# EAGLE design RefOsc10MHz_2V1 (EAGLE 7.2.0)
DF4IAH - 10 MHz Reference Oscillator

## Sheet 1 of 2: Main
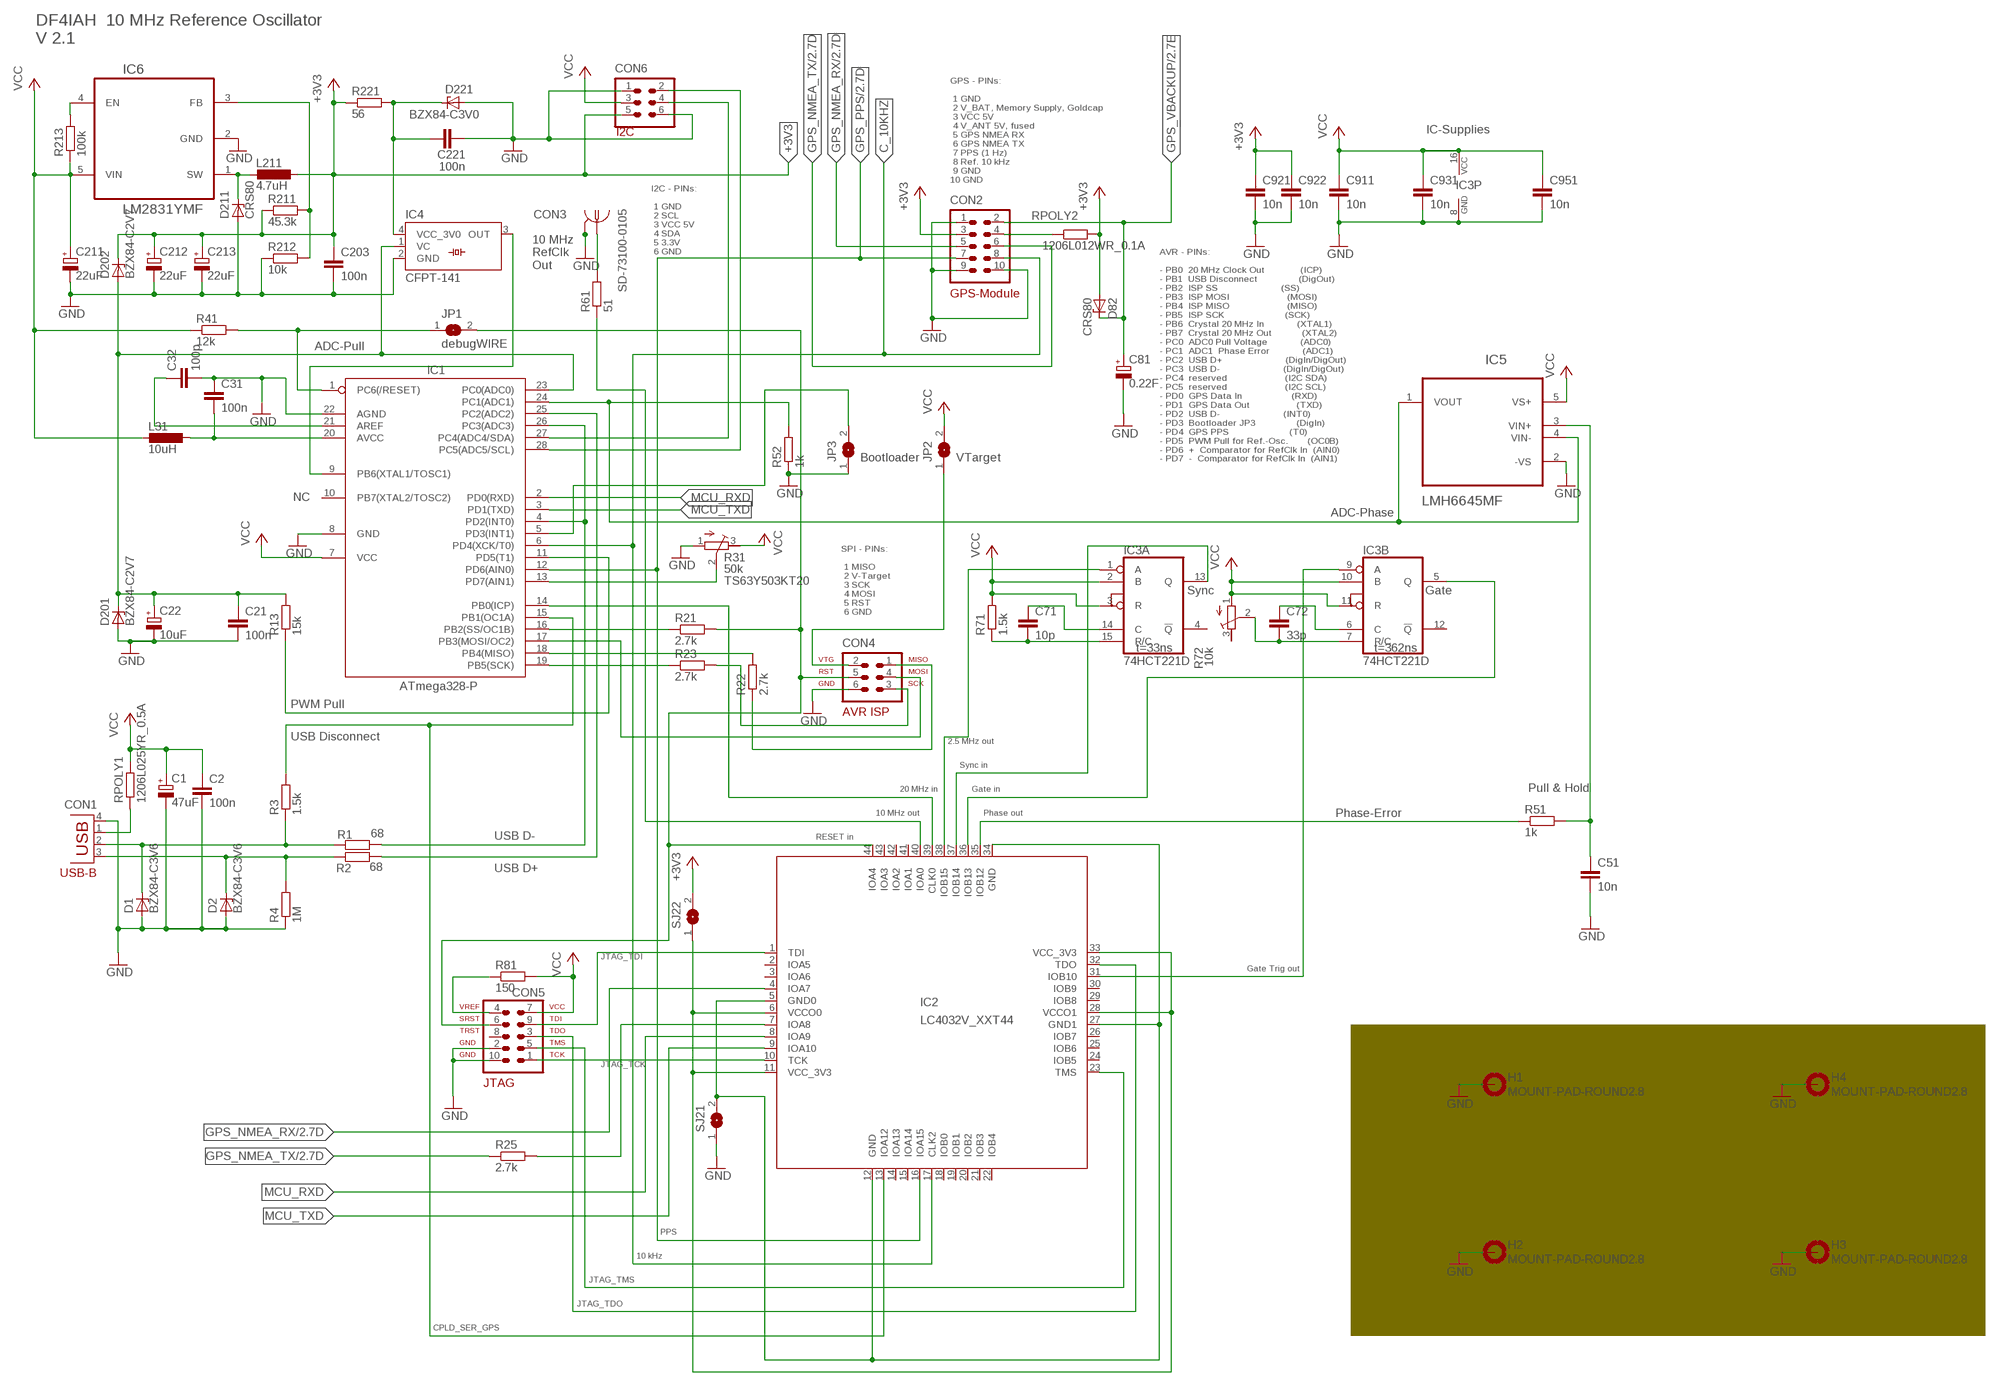
[diagram p0: schematic, sheet 1]

### Parts
C1  47uF  CPOL-EUC  [PANASONIC_C]
C2  100n  C-EUC0805  [C0805]
C21  100n  C-EUC0805  [C0805]
C22  10uF  CPOL-EUB  [PANASONIC_B]
C31  100n  C-EUC0805  [C0805]
C32  100p  C-EUC0805  [C0805]
C51  10n  C-EUC0805  [C0805]
C71  10p  C-EUC0805  [C0805]
C72  33p  C-EUC0805  [C0805]
C81  0.22F  CPOL-EU140CLH-1010  [140CLH-1010]
C203  100n  C-EUC0805  [C0805]
C211  22uF  CPOL-EUA/3216-18W  [A/3216-18W]
C212  22uF  CPOL-EUA/3216-18W  [A/3216-18W]
C213  22uF  CPOL-EUA/3216-18W  [A/3216-18W]
C221  100n  C-EUC0805  [C0805]
C911  10n  C-EUC0805  [C0805]
C921  10n  C-EUC0805  [C0805]
C922  10n  C-EUC0805  [C0805]
C931  10n  C-EUC0805  [C0805]
C951  10n  C-EUC0805  [C0805]
CON1  TYCO-AMP_USBUSB-B_SMT  [TYCO-AMP_USB-B_SMT]
CON2  HEADER-2X5SMD  [2X5SMD]
CON3  SD-73100-0105  MOLEX_BNC-JACK-50R_SD-73100-0105  [MOLEX_BNC-JACK-50R_SD-73100-0105]
CON4  AVR-ISP-6SMD  [2X3SMD]
CON5  AVR-JTAG-10SMD  [2X5SMD]
CON6  HEADER-2X3SMD  [2X03SMD]
D1  BZX84-C3V6  BZX84CSMD  [TO236]
D2  BZX84-C3V6  BZX84CSMD  [TO236]
D82  CRS80  ZENER-DIODESOD80C  [SOD80C]
D201  BZX84-C2V7  BZX84CSMD  [TO236]
D202  BZX84-C2V7  BZX84CSMD  [TO236]
D211  CRS80  ZENER-DIODESOD80C  [SOD80C]
D221  BZX84-C3V0  BZX84CSMD  [TO236]
H1  MOUNT-PAD-ROUND2.8  [2,8-PAD]
H2  MOUNT-PAD-ROUND2.8  [2,8-PAD]
H3  MOUNT-PAD-ROUND2.8  [2,8-PAD]
H4  MOUNT-PAD-ROUND2.8  [2,8-PAD]
IC1  ATmega328-P  MEGA8-P  [DIL28-3]
IC2  LC4032V_XXT44  [TQFP44]
IC3  74HCT221D  [SO16]
IC4  CFPT-141  [CFPT-141]
IC5  LMH6645MF  [SOT95P280X145-5N]
IC6  LM2831YMF  [SOT95P280X145-5N]
JP1  SJW  [SJW]
JP2  SJW  [SJW]
JP3  SJW  [SJW]
L31  10uH  L-EUL1812  [L1812]
L211  4.7uH  L-EUL5650M  [L5650M]
R1  68  R-EU_R0805  [R0805]
R2  68  R-EU_R0805  [R0805]
R3  1.5k  R-EU_R0805  [R0805]
R4  1M  R-EU_R0805  [R0805]
R13  15k  R-EU_R0805  [R0805]
R21  2.7k  R-EU_R0805  [R0805]
R22  2.7k  R-EU_R0805  [R0805]
R23  2.7k  R-EU_R0805  [R0805]
R25  2.7k  R-EU_R0805  [R0805]
R31  50k  R-TRIMMTS63Y  [RTRIMTS63Y]
R41  12k  R-EU_R0805  [R0805]
R51  1k  R-EU_R0805  [R0805]
R52  1k  R-EU_R0805  [R0805]
R61  51  R-EU_R0805  [R0805]
R71  1.5k  R-EU_R0805  [R0805]
R72  10k  R-TRIMMTS63Y  [RTRIMTS63Y]
R81  150  R-EU_R0805  [R0805]
R211  45.3k  R-EU_R0805  [R0805]
R212  10k  R-EU_R0805  [R0805]
R213  100k  R-EU_R0805  [R0805]
R221  56  R-EU_R0805  [R0805]
RPOLY1  1206L025YR_0.5A  R-EU_M1206  [M1206]
RPOLY2  1206L012WR_0.1A  R-EU_M1206  [M1206]
SJ21  SJ  [SJ]
SJ22  SJ  [SJ]

### Nets
+3V0 [N3V3]: C221.1 D221.C IC4.4(VCC_3V0) R221.2
+3V3 [N3V3]: C203.1 C212.+ C213.+ C921.1 C922.1 CON2.3 CON6.5 D82.A D202.C L211.1 R211.1 R221.1 RPOLY2.2 SJ22.2 ; also sheet 2
ADC_PHASE: IC1.24(PC1(ADC1)) IC5.1(VOUT) IC5.4(VIN-) R52.2
ADC_PHASE_PULLHOLD: C51.1 IC5.3(VIN+) R51.2
AIN1: IC1.13(PD7(AIN1)) R31.2(S)
AREF: C32.1 IC1.21(AREF)
AVCC: C31.2 IC1.20(AVCC) L31.1
C_2MHZ5: IC2.38(IOB15) IC3.1(A:A)
C_10KHZ: CON2.8 IC1.6(PD4(XCK/T0)) IC2.17(CLK2)
C_10MHZ: IC2.40(IOA0) R61.1
C_20MHZ: IC1.14(PB0(ICP)) IC2.39(CLK0)
CPLD_GPS_NMEA_TX: IC2.7(IOA8) R25.2
EN: IC6.4(EN) R213.2
FB: IC6.3(FB) R211.2 R212.2
GATE: IC2.36(IOB13) IC3.5(B:Q)
GATE_TRIG: IC2.31(IOB10) IC3.9(B:A)
GND [N0V]: C1.- C2.2 C21.2 C22.- C31.1 C32.2 C51.2 C81.- C203.2 C211.- C212.- C213.- C221.2 C911.2 C921.2 C922.2 C931.2 C951.2 CON1.4(GND) CON2.1 CON2.9 CON2.10 CON3.2 CON3.3 CON4.6 CON5.2 CON5.10 CON6.1 CON6.6 D1.A D2.A D201.A D211.A D221.A H1.B2,8(MOUNT) H2.B2,8(MOUNT) H3.B2,8(MOUNT) H4.B2,8(MOUNT) IC1.8(GND) IC1.22(AGND) IC3.8(P:GND) IC4.2(GND) IC5.2(-VS) IC6.2(GND) JP3.1 R4.1 R31.1(A) R52.1 R212.1 SJ21.1 ; also sheet 2
GND_SJ1: IC2.5(GND0) IC2.12(GND) IC2.27(GND1) IC2.34(GND) SJ21.2
GPS_ANT_PWR [N5V]: CON2.4 RPOLY2.1
GPS_NMEA_RX: CON2.5 IC2.4(IOA7) ; also sheet 2
GPS_NMEA_TX: CON2.6 R25.1 ; also sheet 2
GPS_PPS: CON2.7 IC1.12(PD6(AIN0)) IC2.16(IOA15) ; also sheet 2
GPS_VBACKUP: C81.+ CON2.2 D82.C ; also sheet 2
INT1: IC1.5(PD3(INT1)) JP3.2
ISP_MISO: CON4.1 R22.1
ISP_MOSI: CON4.4 IC1.17(PB3(MOSI/OC2))
ISP_SCK: CON4.3 R23.2
ISP_VTARGET: CON4.2 JP2.1
JTAG_SRST: CON4.5 CON5.6 IC2.44(IOA4) JP1.2 R21.2
JTAG_TCK: CON5.1 IC2.10(TCK)
JTAG_TDI: CON5.9 IC2.1(TDI)
JTAG_TDO: CON5.3 IC2.32(TDO)
JTAG_TMS: CON5.5 IC2.23(TMS)
JTAG_VREF: CON5.4 R81.1
MCU_RXD: IC1.2(PD0(RXD)) IC2.8(IOA9)
MCU_TXD: IC1.3(PD1(TXD)) IC2.9(IOA10)
MISO: IC1.18(PB4(MISO)) R22.2
N$1: CON6.2 IC1.28(PC5(ADC5/SCL))
N$3: CON6.4 IC1.27(PC4(ADC4/SDA))
N$42: CON3.1 R61.2
N$44: C72.2 IC3.7(B:R/C) R72.2(S)
N$45: C72.1 IC3.6(B:C)
N$47: C71.2 IC3.15(A:R/C) R71.1
N$48: C71.1 IC3.14(A:C)
N_ADC_PULL: C21.1 C22.+ D201.C D202.A IC1.23(PC0(ADC0)) IC4.1(VC) R13.2
N_PWM_PULL: IC1.11(PD5(T1)) R13.1
N_USB_DISC: IC1.15(PB1(OC1A)) IC2.13(IOA12) R3.2
N_USB_DMNS: IC1.4(PD2(INT0)) IC1.26(PC3(ADC3)) R1.2
N_USB_DPLS: IC1.25(PC2(ADC2)) R2.2
PHASE_ERROR: IC2.35(IOB12) R51.1
RESET: IC1.1(PC6(/RESET)) JP1.1 R41.2
SCK: IC1.19(PB5(SCK)) R23.1
SS: IC1.16(PB2(SS/OC1B)) R21.1
SW [N3V3]: D211.C IC6.1(SW) L211.2
SYNC: IC2.37(IOB14) IC3.13(A:Q)
TOSC1: IC1.9(PB6(XTAL1/TOSC1)) IC4.3(OUT)
USB_D_MIN: CON1.2(D-) D1.C R1.1 R3.1
USB_D_PLS: CON1.3(D+) D2.C R2.1 R4.2
USB_PWR: CON1.1(VBUS) RPOLY1.1
VCC [N5V]: C1.+ C2.1 C211.+ C911.1 C931.1 C951.1 CON5.7 CON6.3 IC1.7(VCC) IC3.2(A:B) IC3.3(A:R) IC3.10(B:B) IC3.11(B:R) IC3.16(P:VCC) IC5.5(VS+) IC6.5(VIN) JP2.2 L31.2 R31.3(E) R41.1 R71.2 R72.1(A) R81.2 R213.1 RPOLY1.2
VCC_3V3_SJ2: IC2.6(VCCO0) IC2.11(VCC_3V3) IC2.28(VCCO1) IC2.33(VCC_3V3) SJ22.1
Unconnected: CON5.8 IC1.10(PB7(XTAL2/TOSC2)) IC2.2(IOA5) IC2.3(IOA6) IC2.14(IOA13) IC2.15(IOA14) IC2.18(IOB0) IC2.19(IOB1) IC2.20(IOB2) IC2.21(IOB3) IC2.22(IOB4) IC2.24(IOB5) IC2.25(IOB6) IC2.26(IOB7) IC2.29(IOB8) IC2.30(IOB9) IC2.41(IOA1) IC2.42(IOA2) IC2.43(IOA3) IC3.4(A:!Q) IC3.12(B:!Q) R72.3(E)

### Notes on the sheet
- DF4IAH  10 MHz Reference Oscillator
  V 2.1
- I2C | IC-Supplies
- GPS - PINs:
  
   1 GND
   2 V_BAT, Memory Supply, Goldcap
   3 VCC 5V
   4 V_ANT 5V, fused
   5 GPS NMEA RX
   6 GPS NMEA TX
   7 PPS (1 Hz)
   8 Ref. 10 kHz
   9 GND
  10 GND
- I2C - PINs:
  
   1 GND
   2 SCL
   3 VCC 5V
   4 SDA
   5 3.3V
   6 GND
- 10 MHz
  RefClk
  Out
- GPS-Module
- ADC-Pull | debugWIRE
- Bootloader | VTarget
- AVR - PINs:
  
  - PB0  20 MHz Clock Out             (ICP)
  - PB1  USB Disconnect               (DigOut)
  - PB2  ISP SS                       (SS)
  - PB3  ISP MOSI                     (MOSI)
  - PB4  ISP MISO                     (MISO)
  - PB5  ISP SCK                      (SCK)
  - PB6  Crystal 20 MHz In            (XTAL1)
  - PB7  Crystal 20 MHz Out           (XTAL2)
  - PC0  ADC0 Pull Voltage            (ADC0)
  - PC1  ADC1  Phase Error            (ADC1)
  - PC2  USB D+                       (DigIn/DigOut)
  - PC3  USB D-                       (DigIn/DigOut)
  - PC4  reserved                     (I2C SDA)
  - PC5  reserved                     (I2C SCL)
  - PD0  GPS Data In                  (RXD)
  - PD1  GPS Data Out                 (TXD)
  - PD2  USB D-                       (INT0)
  - PD3  Bootloader JP3               (DigIn)
  - PD4  GPS PPS                      (T0)
  - PD5  PWM Pull for Ref.-Osc.       (OC0B)
  - PD6  +  Comparator for RefClk In  (AIN0)
  - PD7  -  Comparator for RefClk In  (AIN1)
- NC
- ADC-Phase
- Sync | Gate
- SPI - PINs:
  
   1 MISO
   2 V-Target
   3 SCK
   4 MOSI
   5 RST
   6 GND
- t=33ns | t=362ns
- PWM Pull
- USB Disconnect
- 2.5 MHz out
- Sync in
- 20 MHz in | Gate in | Pull & Hold
- 10 MHz out | Phase out | Phase-Error
- USB D- | RESET in
- USB D+
- USB-B
- JTAG_TDI
- Gate Trig out
- JTAG_TCK
- PPS
- 10 kHz
- JTAG_TMS
- JTAG_TDO
- CPLD_SER_GPS

## Sheet 2 of 2: GPS-Unit
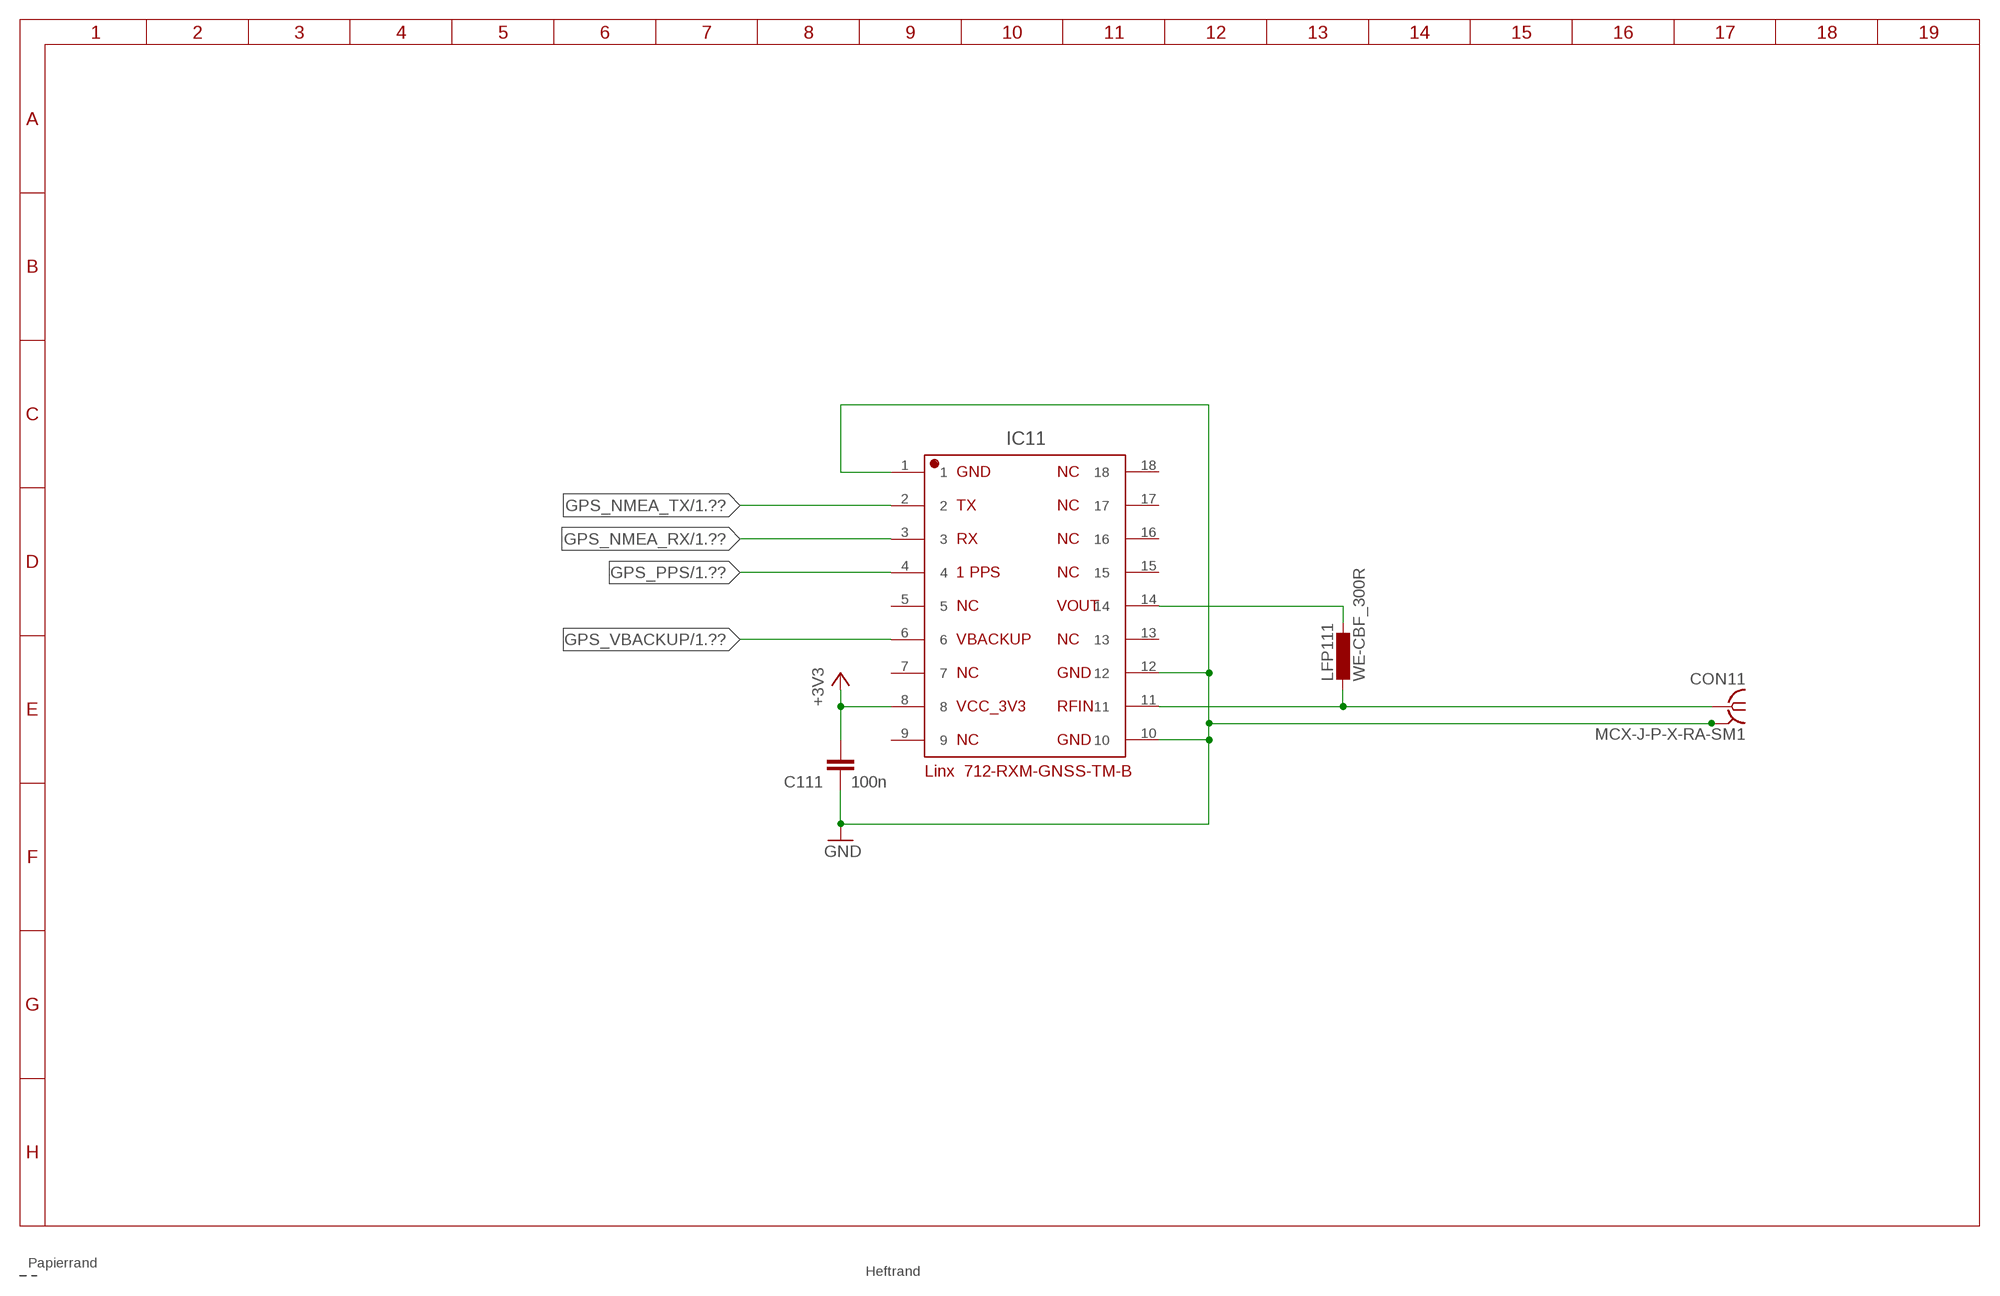
[diagram p1: schematic, sheet 2]

### Parts
C111  100n  C-EUC0805  [C0805]
CON11  MCX-J-P-X-RA-SM1  [MCX-J-P-X-RA-SM1]
IC11  712-RXM-GNSS-TM-B  [712-RXM-GNSS-TM-B]
LFP111  WE-CBF_300R  L-EUL3216C  [L3216C]

### Nets
14: IC11.14 LFP111.1
+3V3 [N3V3]: C111.1 IC11.8 ; also sheet 1
GND [N0V]: C111.2 CON11.2 CON11.3 CON11.4 CON11.5 IC11.1 IC11.10 IC11.12 ; also sheet 1
GPS_HF: CON11.1 IC11.11 LFP111.2
GPS_NMEA_RX: IC11.3 ; also sheet 1
GPS_NMEA_TX: IC11.2 ; also sheet 1
GPS_PPS: IC11.4 ; also sheet 1
GPS_VBACKUP: IC11.6 ; also sheet 1
Unconnected: IC11.5 IC11.7 IC11.9 IC11.13 IC11.15 IC11.16 IC11.17 IC11.18

## Library data of the parts
C1 C22 C81 C211-C213 = rcl:CPOL-EU: POLARIZED CAPACITOR, European symbol
C2 C21 C31 C32 C51 C71 C72 C203 C221 C911 C921 C922 C931 C951 = rcl:C-EU: CAPACITOR, European symbol
C111 = df4iah:C-EU: CAPACITOR, European symbol
CON1 = df4iah:TYCO-AMP_USB: TYCO-AMP USB-Connectors From Catalog 7-1773422-0 Issued 03-06; MF: TYCO-AMP; MPN: 1734346; OC_FARNELL: 1321918
CON2 = df4iah:HEADER-2X5: Header 2X5 2.54mm ISP, JTAG, ...
CON3 = df4iah:MOLEX_BNC-JACK-50R_SD-73100-0105: MOLEX BNC-Jack 50 Ohm SD-73100-0102; MF: MOLEX; MPN: SD-73100-0105; OC_FARNELL: 1909203; OC_NEWARK: -
CON4 = atmel-1:AVR-ISP-6: AVR ISP-6 Serial Programming Header
CON5 = df4iah:AVR-JTAG-10: AVR JTAG Debug/Programming Header
CON6 = df4iah:HEADER-2X3: Header 2X3 2.54mm ISP, ...
CON11 = df4iah:MCX-J-P-X-RA-SM1: FEMALE SMA CONNECTOR Radiall
D1 D2 D201 D202 D221 = diode:BZX84CSMD: Z DIODE
D82 D211 = diode:ZENER-DIODE: Z-Diode
H1-H4 = holes:MOUNT-PAD-ROUND: MOUNTING PAD, round
IC1 = atmel:MEGA8-P: MICROCONTROLLER 8 Kbytes FLASH 1 kbytes SRAM 512 bytes EEPROM USART 4-channel 10 bit ADC 2-channel 8 bit ADC
IC2 = df4iah:LC4032V_XXT44: bsdliscispmach4032v44pintqfp Auto generated by make-symbol-device-package-bsdl.ulp Rev. 44 Source: bsdliscispmach4032v44pintqfp.BSM Created by: DF4IAH
IC3 = 74xx-eu:74*221: Dual Monostable MULTIVIBRATOR, schmitt trigger inputs
IC4 = df4iah:CFPT-141: TCXO, 3.0V; MF: IQD-FREQUENCY-PRODUCTS; MPN: LFTVXO022175; OC_FARNELL: 1100745; OC_NEWARK: -
IC5 = df4iah:LMH6645MF: Wideband, Fixed Gain, JFET-Input AMPLIFIER; OC_FARNELL: 1312813; OC_NEWARK: -; PACKAGE: SOT-23-5; SUPPLIER: Texas Instruments
IC6 = df4iah:LM2831: HIGH-EFFICIENCY, SOT23 STEP-DOWN, DC-DC CONVERTER; MPN: LM2831YMF/NOPB; OC_FARNELL: 1286714; OC_NEWARK: -; PACKAGE: SOT-23-5; SUPPLIER: National Semiconductor
IC11 = df4iah:712-RXM-GNSS-TM-B: Linx TM-Series 712-RXM-GNSS-TM-B Linx Technologies TM Series GNSS Receiver Module data entry: 2015-01-11 by DF4IAH.
JP1-JP3 SJ21 SJ22 = jumper:SJ: SMD solder JUMPER
L31 L211 = rcl:L-EU: INDUCTOR, European symbol
LFP111 = df4iah:L-EU: INDUCTOR, European symbol
R1-R4 R13 R21-R23 R25 R41 R51 R52 R61 R71 R81 R211-R213 R221 RPOLY1 RPOLY2 = rcl:R-EU_: RESISTOR, European symbol
R31 = df4iah:R-TRIMM: Trimm resistor; NR: TS63Y503KT20
R72 = df4iah:R-TRIMM: Trimm resistor

## Net classes
1 N3V3: width 0.508 mm
2 N5V: width 0.508 mm
3 N0V: width 0.508 mm

## Board
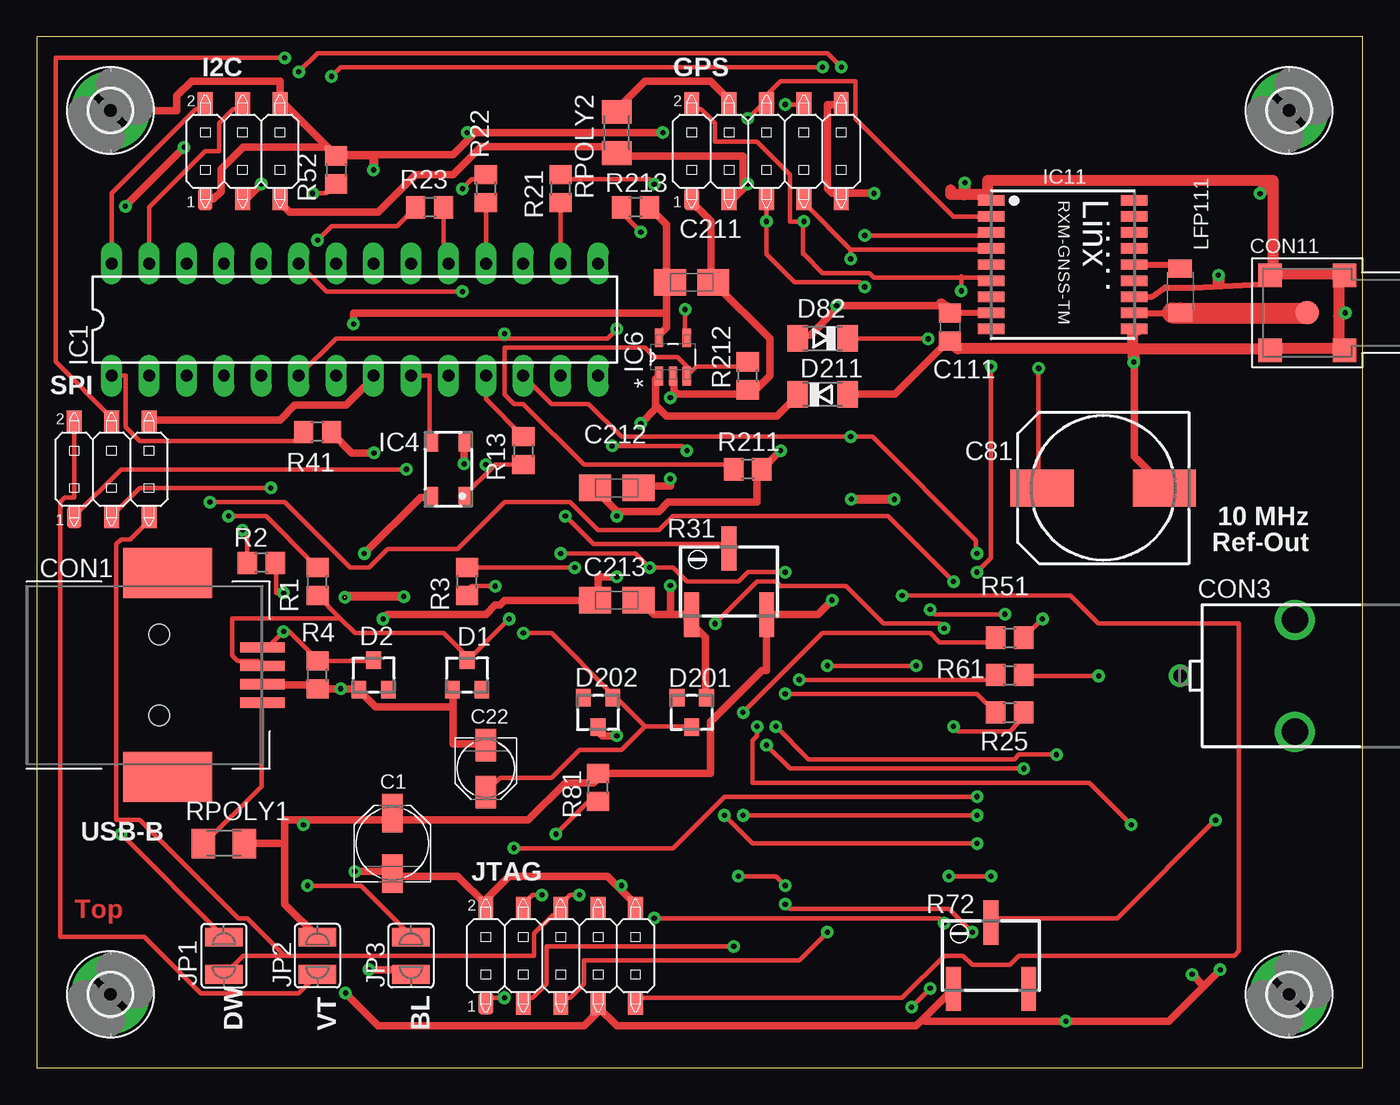
[diagram p2: board, top side]
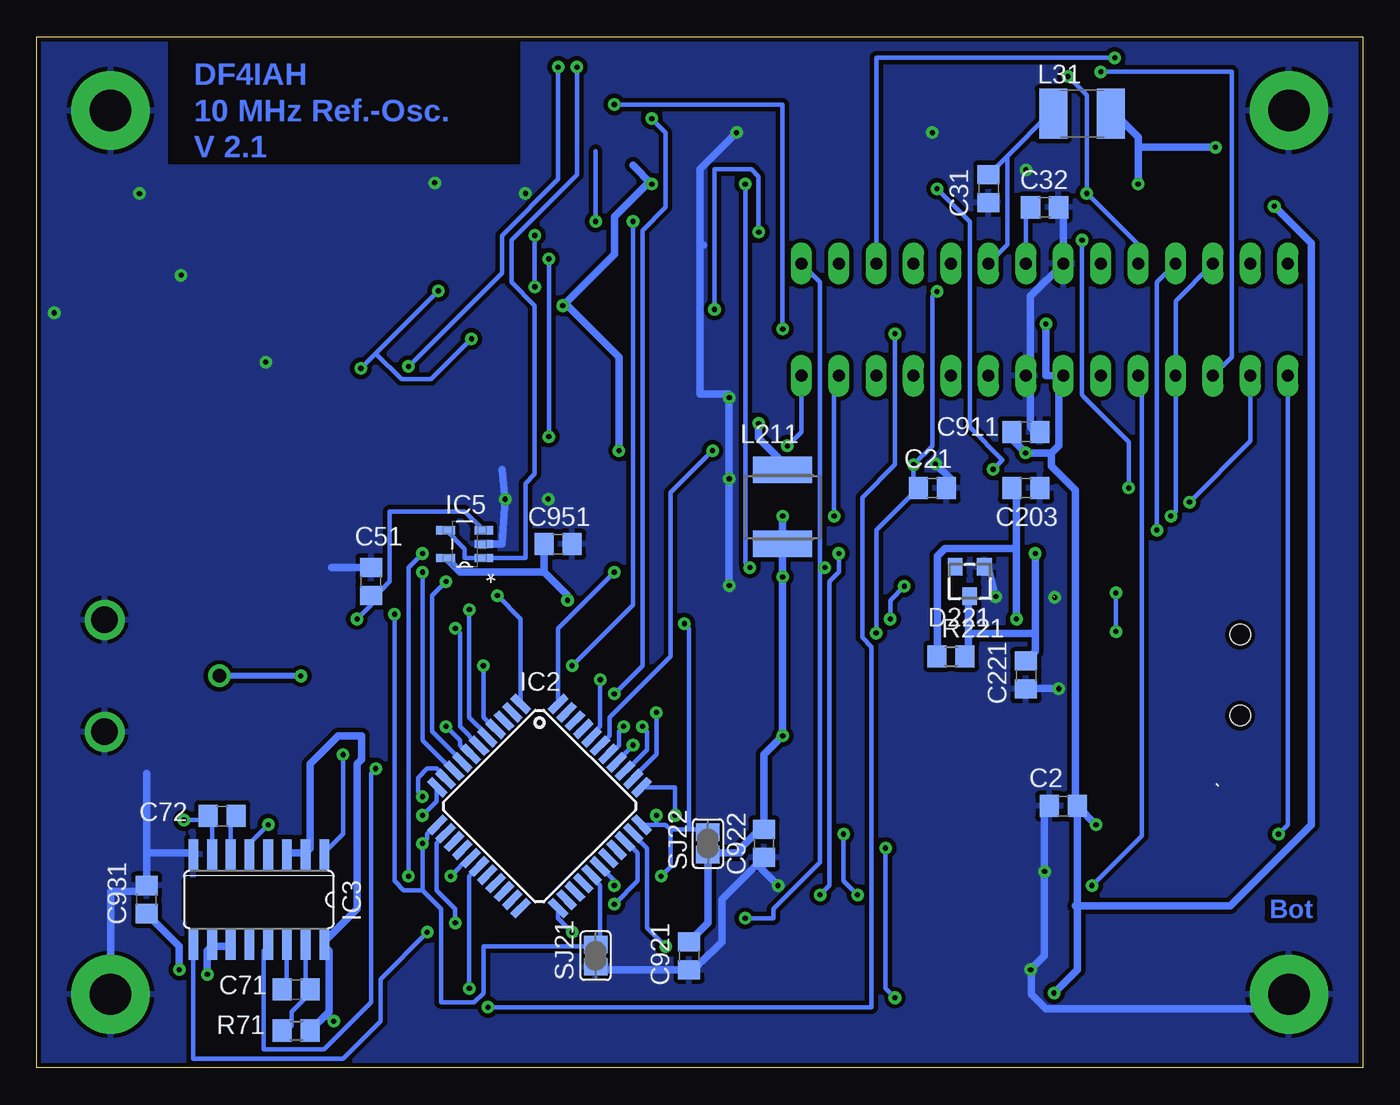
[diagram p3: board, bottom side, seen from below]

Size 90 x 70 mm. Coordinates in mm from the lower left corner, seen from the top.
Outline: 0,0 90,0 90,70 0,70 0,0
Copper layers (1*16): Top 0.035mm / dielectric 1.5mm / Bottom 0.035mm
Design rules "HSMA_20150114": minimum track width 0.3mm, minimum drill 0.35mm, track to track 0.3mm, track to pad 0.3mm, pad to pad 0.3mm, via to via 0.3mm, smd to smd 0mil, copper to edge 0.3mm, drill to drill 0.35mm, minimum pad ring 0.3mm, minimum via ring 0.25mm, stop-mask expansion 0mil, vias tented up to drill 0.45mm, thermal gap 0.3mm
bRestrict: area 49.5,11.4 to 62.2,24.1; area 69.8,10.2 to 80,12.7

### Footprints (pad centres in the part's own frame; a part is rotated, then mirrored left to right if it is on the bottom)
PANASONIC_C = smd 2.6 x 1.4: + 2.05,0; - -2.05,0
C0805 = smd 1.3 x 1.5: 1 -0.95,0; 2 0.95,0
PANASONIC_B = smd 2.2 x 1.4: + 1.6,0; - -1.6,0
140CLH-1010 = smd 4.3 x 2.5: + 4.15,0; - -4.15,0
A/3216-18W = smd 2.15 x 1.8: + 1.475,0; - -1.475,0
TYCO-AMP_USB-B_SMT = smd 6.04 x 3.4: 0A 0,6.92; 0B 0,-6.92 | smd 3 x 0.7: 1 -6.42,1.87; 2 -6.42,-0.62; 3 -6.42,-1.87; 4 -6.42,0.62 | hole 1.4: 0.58,-2.75; 0.58,2.75
2X5SMD = smd 1 x 1.5: 1 -5.08,-3.25; 2 -5.08,3.25; 3 -2.54,-3.25; 4 -2.54,3.25; 5 0,-3.25; 6 0,3.25; 7 2.54,-3.25; 8 2.54,3.25; 9 5.08,-3.25; 10 5.08,3.25
MOLEX_BNC-JACK-50R_SD-73100-0105 = drill 0.92: 1 12.4,0 | drill 1.8: 2 4.6,3.8; 3 4.6,-3.8
2X3SMD = smd 1 x 1.5: 1 -2.54,-3.25; 2 -2.54,3.25; 3 0,-3.25; 4 0,3.25; 5 2.54,-3.25; 6 2.54,3.25
2X03SMD = smd 1 x 1.5: 1 -2.54,-3.25; 2 -2.54,3.25; 3 0,-3.25; 4 0,3.25; 5 2.54,-3.25; 6 2.54,3.25
MCX-J-P-X-RA-SM1 = smd 1.6 x 1.6: 1 0,0; 2 -2.54,2.54; 3 2.54,2.54; 4 -2.54,-2.54; 5 2.54,-2.54
TO236 = smd 1 x 1.2: A -1,-1; C 0,1; NC 1,-1
SOD80C = smd 1.4 x 1.8: A 1.7,0; C -1.7,0
2,8-PAD = drill 2.8 pad 5.334: B2,8 0,0
DIL28-3 = drill 0.813 long: 1 -16.51,-3.81; 2 -13.97,-3.81; 3 -11.43,-3.81; 4 -8.89,-3.81; 5 -6.35,-3.81; 6 -3.81,-3.81; 7 -1.27,-3.81; 8 1.27,-3.81; 9 3.81,-3.81; 10 6.35,-3.81; 11 8.89,-3.81; 12 11.43,-3.81; 13 13.97,-3.81; 14 16.51,-3.81; 15 16.51,3.81; 16 13.97,3.81; 17 11.43,3.81; 18 8.89,3.81; 19 6.35,3.81; 20 3.81,3.81; 21 1.27,3.81; 22 -1.27,3.81; 23 -3.81,3.81; 24 -6.35,3.81; 25 -8.89,3.81; 26 -11.43,3.81; 27 -13.97,3.81; 28 -16.51,3.81
TQFP44 = smd 1.5 x 0.5: 1 -5.8,4; 2 -5.8,3.2; 3 -5.8,2.4; 4 -5.8,1.6; 5 -5.8,0.8; 6 -5.8,0; 7 -5.8,-0.8; 8 -5.8,-1.6; 9 -5.8,-2.4; 10 -5.8,-3.2; 11 -5.8,-4; 23 5.8,-4; 24 5.8,-3.2; 25 5.8,-2.4; 26 5.8,-1.6; 27 5.8,-0.8; 28 5.8,0; 29 5.8,0.8; 30 5.8,1.6; 31 5.8,2.4; 32 5.8,3.2; 33 5.8,4 | smd 0.5 x 1.5: 12 -4,-5.8; 13 -3.2,-5.8; 14 -2.4,-5.8; 15 -1.6,-5.8; 16 -0.8,-5.8; 17 0,-5.8; 18 0.8,-5.8; 19 1.6,-5.8; 20 2.4,-5.8; 21 3.2,-5.8; 22 4,-5.8; 34 4,5.8; 35 3.2,5.8; 36 2.4,5.8; 37 1.6,5.8; 38 0.8,5.8; 39 0,5.8; 40 -0.8,5.8; 41 -1.6,5.8; 42 -2.4,5.8; 43 -3.2,5.8; 44 -4,5.8
SO16 = smd 0.66 x 2.032: 1 -4.445,-3.073; 2 -3.175,-3.073; 3 -1.905,-3.073; 4 -0.635,-3.073; 5 0.635,-3.073; 6 1.905,-3.073; 7 3.175,-3.073; 8 4.445,-3.073; 9 4.445,3.073; 10 3.175,3.073; 11 1.905,3.073; 12 0.635,3.073; 13 -0.635,3.073; 14 -1.905,3.073; 15 -3.175,3.073; 16 -4.445,3.073
CFPT-141 = smd 1.4 x 0.9: 1 -1.9,-1.15; 2 1.9,-1.15; 3 1.9,1.15; 4 -1.9,1.15
SOT95P280X145-5N = smd 1.27 x 0.559: 1 -1.295,0.94; 2 -1.295,0; 3 -1.295,-0.94; 4 1.295,-0.94; 5 1.295,0.94
712-RXM-GNSS-TM-B = smd 1.803 x 0.711: 1 -4.847,4.369; 2 -4.847,3.277; 3 -4.847,2.184; 4 -4.847,1.092; 5 -4.847,0; 6 -4.847,-1.092; 7 -4.847,-2.184; 8 -4.847,-3.277; 9 -4.847,-4.369; 10 4.847,-4.369; 11 4.847,-3.277; 12 4.847,-2.184; 13 4.847,-1.092; 14 4.847,0; 15 4.847,1.092; 16 4.847,2.184; 17 4.847,3.277; 18 4.847,4.369
SJW = smd 1.27 x 2.54: 1 -1.27,0; 2 1.27,0
L1812 = smd 1.9 x 3.4: 1 -1.95,0; 2 1.95,0
L5650M = smd 1.8 x 4: 1 -2.5,0; 2 2.5,0
L3216C = smd 1.2 x 1.6: 1 -1.5,0; 2 1.5,0
R0805 = smd 1.3 x 1.5: 1 -0.95,0; 2 0.95,0
RTRIMTS63Y = smd 1 x 3: 1 -2.55,-2.25; 2 0,2.25; 3 2.55,-2.25
M1206 = smd 1.6 x 2: 1 -1.4,0; 2 1.4,0
SJ = smd 1.168 x 1.6: 1 -0.762,0; 2 0.762,0

### Placement (x,y rotation side)
C1  24.13,15.24 90 top
C2  20.32,17.78 180 bottom
C21  29.21,39.37 0 bottom
C22  30.48,20.32 270 top
C31  25.4,59.69 90 bottom
C32  21.59,58.42 0 bottom
C51  67.31,33.02 90 bottom
C71  72.39,5.33 0 bottom
C72  77.41,17.11 180 bottom
C81  72.39,39.37 180 top
C111  61.99,50.3 270 top
C203  22.86,39.37 0 bottom
C211  44.45,53.34 180 top
C212  39.37,39.37 180 top
C213  39.37,31.75 180 top
C221  22.86,26.67 270 bottom
C911  22.86,43.18 0 bottom
C921  45.72,7.62 270 bottom
C922  40.64,15.24 270 bottom
C931  82.55,11.43 90 bottom
C951  54.61,35.56 0 bottom
CON1  8.89,26.67 180 top
CON2  49.53,62.23 0 top
CON3  90,26.62 180 top
CON4  5.08,40.64 0 top
CON5  35.56,7.62 0 top
CON6  13.97,62.23 0 top
CON11  86.24,51.27 270 top
D1  29.21,26.67 0 top
D2  22.86,26.67 0 top
D82  53.34,49.53 180 top
D201  44.45,24.13 180 top
D202  38.1,24.13 180 top
D211  53.34,45.72 0 top
D221  26.67,33.02 180 bottom
H1  5,65 0 top
H2  5,5 0 top
H3  85,5 0 top
H4  85,65 0 top
IC1  21.59,50.8 0 top
IC2  55.88,17.78 315 bottom
IC3  74.93,11.43 180 bottom
IC4  27.94,40.64 90 top
IC5  60.96,35.56 180 bottom
IC6  43.18,48.26 90 top
IC11  69.64,54.53 0 top
JP1  12.7,7.62 270 top
JP2  19.05,7.62 90 top
JP3  25.4,7.62 90 top
L31  19.05,64.77 0 bottom
L211  39.37,38.1 90 bottom
LFP111  77.61,52.77 270 top
R1  19.05,33.02 90 top
R2  15.24,34.29 180 top
R3  29.21,33.02 90 top
R4  19.05,26.67 90 top
R13  33.02,41.91 270 top
R21  35.56,59.69 90 top
R22  30.48,59.69 270 top
R23  26.67,58.42 180 top
R25  66.04,24.13 0 top
R31  46.99,33.02 0 top
R41  19.05,43.18 180 top
R51  66.04,29.21 0 top
R52  20.32,60.96 270 top
R61  66.04,26.67 0 top
R71  72.39,2.54 0 bottom
R72  64.77,7.62 0 top
R81  38.1,19.05 90 top
R211  48.26,40.64 180 top
R212  48.26,46.99 90 top
R213  40.64,58.42 180 top
R221  27.94,27.94 0 bottom
RPOLY1  12.7,15.24 0 top
RPOLY2  39.37,63.5 270 top
SJ21  52.07,7.62 90 bottom
SJ22  44.45,15.24 270 bottom

### Tracks (layer width: path | path; a pad name or v marks a point on that pad's centre or on a via)
14
  Top 0.406: IC11.14 77.58,54.53 LFP111.1
+3V0  (via drill 0.35)
  Top 0.508: 26.99,38.73 IC4.4 26.67,38.73 26.04,38.73 v22.23,34.92
  Bottom 0.508: v22.23,34.92 22.23,29.5 | 22.23,29.5 22.23,28.26 C221.1 22.88,27.62 C221.1 | 26.75,29.5 26.75,28.12 26.88,28 R221.2 | 26.75,29.5 26.75,32 D221.C | 26.75,29.5 22.23,29.5
+3V3  (via drill 0.35)
  Top 0.406: IC11.8 64.78,51.25 C111.1
  Top 0.508: CON2.3 46.99,59.05 47.31,59.05 v48.26,60.01 47.94,60.01 47.94,61.91 39.37,61.91 RPOLY2.2 39.37,62.23 39.05,62.55 30.16,62.55 28.26,60.64 25.72,60.64 23.18,58.1 17.14,58.1 16.51,58.74 CON6.5 | C111.1 61.28,51.75 v54.29,51.75 54.25,51.5 52.5,49.75 51.75,49.75 D82.A | v23.5,30.48 23.81,30.8 30.48,30.8 31.11,31.43 31.43,31.43 31.75,31.75 C213.+ 38.1,31.75 38.1,33.34 v39.37,33.34 | 39.37,37.78 42.23,37.78 42.86,38.42 48.9,38.42 48.9,40.64 R211.1 v50.48,41.91 | 39.37,37.78 37.78,39.37 C212.+ | v39.37,22.54 38.42,22.54 38.1,22.86 D202.C | v39.37,37.47 39.37,37.78
  Top 0.762: 61.86,51.36 C111.1 | 61.7,51.68 C111.1 | 61.38,51.88 C111.1
  Bottom 0.508: 49.53,61.28 v48.26,60.01 48.58,60.01 50.8,57.78 50.8,55.24 v54.29,51.75 53.98,51.75 50.48,48.26 v50.48,41.91 | v23.5,30.48 23.5,35.25 | 23.5,35.25 23.5,39.37 C203.1 | C921.1 44.45,9.84 SJ22.2 44.45,14.61 42.23,14.61 42.23,14.92 40.64,16.51 | 40.64,16.51 C922.1 | 40.64,16.51 40.64,21.27 v39.37,22.54 v39.37,33.34 L211.1 v39.37,37.47 | 23.5,35.25 28.38,35.25 28.88,34.75 28.88,28 R221.1
ADC_PHASE  (via drill 0.35)
  Top 0.3: v18.73,59.37 19.68,59.37 R52.2 | v53.34,67.94 20.64,67.94 v20,67.31
  Bottom 0.3: IC5.4 62.23,36.51 60.96,35.24 60.96,34.61 59.69,34.61 IC5.1 59.37,34.61 56.83,34.61 56.83,39.69 56.2,40.32 56.2,51.75 57.78,53.34 57.78,56.2 53.34,60.64 v53.34,67.94 | IC1.24 15.24,55.88 v18.73,59.37 18.73,66.04 v20,67.31
ADC_PHASE_PULLHOLD  (via drill 0.35)
  Top 0.3: v68.26,30.48 R51.2
  Bottom 0.3: IC5.3 59.69,36.51 60.96,37.78 66.04,37.78 66.04,33.02 66.67,32.38 67.31,32.38 C51.1 67.31,31.43 v68.26,30.48
AIN1  (via drill 0.35)
  Top 0.3: v35.88,37.47 37.78,35.56 46.99,35.56 R31.2
  Bottom 0.3: IC1.13 35.88,46.67 v35.88,37.47
AREF
  Bottom 0.3: IC1.21 22.86,58.1 C32.1
AVCC
  Bottom 0.3: 24.13,61.91 21.27,64.77 L31.1 | 24.13,61.91 C31.2 | IC1.20 24.13,55.88 24.13,61.91
C_2MHZ5  (via drill 0.35)
  Top 0.3: v50.16,23.18 52.39,20.95 66.36,20.95 66.67,21.27 v69.22,21.27
  Bottom 0.3: v50.16,23.18 50.48,22.86 50.48,21.91 51.12,21.27 IC2.38 | v69.22,21.27 69.22,15.88 70.48,14.61 IC3.1
C_10KHZ  (via drill 0.35)
  Top 0.3: v50.8,65.41 52.07,65.41 CON2.8 | v39.37,50.16 38.73,49.53 31.75,49.53 | 31.75,49.53 20.32,49.53 IC1.6 | v59.37,4.13 v60.64,5.4 | 31.75,49.53 v31.75,49.85
  Bottom 0.3: v50.8,65.41 39.37,65.41 v39.37,50.16 | IC2.17 60.64,13.02 v60.64,5.4 | v59.37,4.13 33.34,4.13 33.34,28.57 33.97,29.21 33.97,38.73 31.75,40.96 v31.75,49.85
C_10MHZ  (via drill 0.35)
  Top 0.3: v51.75,26.35 64.77,26.35 R61.1
  Bottom 0.3: v51.75,26.35 51.75,23.18 52.39,22.54 IC2.40
C_20MHZ  (via drill 0.35)
  Top 0.3: v44.13,41.91 43.81,42.23 v39.05,42.23
  Bottom 0.3: IC2.39 51.12,22.54 51.12,23.81 46.99,27.94 46.99,39.05 v44.13,41.91 | v39.05,42.23 38.1,43.18 IC1.14
CPLD_GPS_NMEA_TX  (via drill 0.35)
  Top 0.3: v62.23,23.18 62.55,22.86 66.04,22.86 66.67,23.5 66.67,24.13 R25.2
  Bottom 0.3: v62.23,23.18 61.28,22.23 61.28,21.91 60.64,21.27 IC2.7
EN  (via drill 0.35)
  Top 0.3: 40.01,57.78 40.01,58.42 R213.2 40,57.75 v41,56.75 | v44,51.5 44,49.75 IC6.4
  Bottom 0.3: v44,51.5 44,61 41.5,61 41,60.5 v41,56.75
FB
  Top 0.3: 44.45,47.31 44.77,47.62 48.26,47.62 R212.2 | 44.45,47.31 44.13,46.99 IC6.3 | 44.45,47.31 43.5,48.26 41.91,48.26 41.27,48.9 31.75,48.9 31.75,45.72 32.38,45.09 33.02,45.09 37.15,40.96 46.99,40.96 R211.2
GATE  (via drill 0.35)
  Top 0.3: v48.9,23.18 48.9,22.54 48.58,22.23 48.58,19.37 71.44,19.37 v74.3,16.51
  Bottom 0.3: v48.9,23.18 48.58,22.86 48.58,21.59 49.85,20.32 IC2.36 | v74.3,16.51 75.56,15.24 IC3.5
GATE_TRIG  (via drill 0.35)
  Top 0.3: v50.8,11.11 51.12,10.79 61.91,10.79 v63.5,9.21
  Bottom 0.3: v50.8,11.11 49.21,12.7 49.21,14.61 49.85,15.24 IC2.31 | v63.5,9.21 66.67,6.03 66.67,3.17 69.22,0.64 79.38,0.64 IC3.9
GND  (via drill 0.35)  (1 unrouted)
  Top 0.406: CON11.4 83.15,53.81 83.15,53.21 78.53,52.97 76.57,52.99 75.64,52.34 75.2,52.35 IC11.12 | 20.95,32 20.95,31.98 | R52.1 22.86,61.91
  Top 0.508: D201.A 45.4,25.4 45.4,29.21 44.13,30.48 R31.1 44.13,30.8 43,30.8 | 43,30.8 41.91,30.8 40.96,31.75 C213.- | CON2.10 54.61,65.41 53.66,65.41 53.66,59.69 53.98,59.37 54.29,59.37 54.61,59.05 CON2.9 54.61,59.37 v56.83,59.37 | 39.53,12.22 38.73,13.02 32.07,13.02 30.48,11.43 CON5.2 30.48,11.11 28.57,13.02 24.13,13.02 C1.- 24.13,13.34 v21.59,13.34 | 39.53,12.22 40.64,11.11 CON5.10 | v39.69,12.38 39.53,12.22 | 20.62,25.72 R4.1 | 20.62,25.72 21.59,25.72 D2.A 22,25.5 23,24.5 28.25,24.5 | 19.05,26.04 R4.1 | JP3.1 25.08,6.67 v22.54,6.67 | CON1.4 15.38,26 18.88,26 R4.1 | H1.B2,8 9.5,65 9.5,66 10.5,67 16.5,67 16.5,65.5 CON6.6 16.75,65.5 19.62,62.62 | C81.- 76.5,39.5 74.5,41.5 74.5,47.5 v74.46,47.92 | D211.A 55.25,45.75 58.25,45.75 61.5,49 C111.2 | 19.62,62.62 20.25,62 R52.1 20.5,62 28.25,62 29.75,63.5 v42.5,63.5 | CON2.1 44.5,58.75 45.75,57.5 45.75,53.5 C211.- 46,53.25 49.75,49.5 49.75,47 48.5,45.75 R212.1 48.25,46 48.25,45.75 43.5,45.75 43.25,46 | 43.25,46 43.25,46.75 IC6.2 | v43,40 43,39.5 41,39.5 C212.- | v43,45.5 43.25,45.75 43.25,46 | v43,32.75 43,30.8 | 28.25,24.5 28.25,22 30.38,22 C22.- | 28.25,24.5 28.25,25.62 D1.A | v20.62,25.75 20.62,25.72 | CON4.6 8,44 16.5,44 17.5,45 21,45 22.5,46.5 IC1.8 | v29,41 29,42.5 IC4.2 | CON6.1 11.5,59 12,59 12.5,59.5 12.5,61 14,62.5 19.5,62.5 19.62,62.62
  Top 0.61: v24.9,32 20.95,32 | 22.86,61.91 v22.86,60.96 | 29.75,63.5 v29.21,63.5 | v55.3,38.62 58.21,38.62 v58.21,38.6
  Top 0.762: 83.92,48.82 88.69,48.82 CON11.3 88.37,49.14 88.37,51.04 | 74.4,48.82 83.92,48.82 | 83.92,48.82 CON11.5 83.61,48.82 | CON11.4 83.92,53.9 88.69,53.9 CON11.2 88.37,53.58 88.37,51.04 | 74.42,48.83 74.41,49.14 | 74.41,49.14 74.4,50.09 | 74.4,50.09 | 83.92,54.22 CON11.4 | 64.56,59.3 64.56,58.98 IC11.1 64.24,58.98 | 64.56,59.3 64.56,60.25 83.92,60.25 83.92,59.77 | 83.92,59.77 83.92,54.53 CON11.4 | 74.41,49.14 74.4,49.14 74.4,48.82 | v88.82,51.26 88.37,51.04 | IC11.10 74.72,50.09 74.4,50.09 | 74.4,48.82 62.49,48.82 62.02,49.3 C111.2 61.7,49.14 | 64.56,59.3 62.97,59.3 | 62.97,59.3 62.02,59.3 62.02,59.61 | 80.25,53.74 80.27,53.74 v80.2,53.81 | 62.96,59.31 62.97,59.61 62.97,59.3 | 74.45,48.51 74.4,48.5 74.4,48.82 | 83.53,59.86 83.61,59.77 83.92,59.77
  Top 0.813: 62.96,60.09 62.96,59.31 | 83,59.36 83.53,59.86 83.89,60.21 | 74.5,47.88 74.45,48.51 74.43,48.79 | 80.23,53.3 80.25,53.74 80.25,53.81
  Bottom 0.406: D221.A 25.4,34.02 v24.9,32
  Bottom 0.508: IC5.2 58.42,35.56 v58.21,38.6 58.42,40.64 | 70,33.97 C51.2 | 82.55,20 82.55,14.61 | 82.55,14.61 C931.2 83,12 85,12 H3.B2,8 | 82.55,14.61 79.38,14.61 IC3.8 | v56.83,59.37 57,59.37 | C911.2 22.23,43.18 22.54,43.5 22.54,46.67 IC1.8 22.54,46.99 22.54,52.39 IC1.22 20.32,58.1 C32.2 20.75,58.5 20.76,58.54 | SJ21.1 52.07,6.67 C921.2 45.72,6.99 45.09,6.99 43.5,8.57 43.5,11.43 C922.2 40.96,13.65 v39.69,12.38 | C2.2 21.59,17.78 v21.59,13.34 21.59,7.62 v22.54,6.67 22.5,6.5 22.5,5 21.5,4 6,4 H2.B2,8 | v42.5,63.5 45,61 45,55.88 | 45,55.88 45,45.75 43,45.75 v43,45.5 v43,40 v43,32.75 | 44.75,55.88 45,55.88 | v20.62,25.75 22.75,25.75 C221.2 | v29,41 28,40 28,39.5 C21.2
  other vias: 83.03,59.36 62.99,60.09 20.9,31.94
  pour Bottom: 57,61.1 81.28,61.1 81.28,69.85 90,69.85 90,20 90.17,20.32 90.17,0 0,0 0,69.85 57,69.85
GND_SJ1  (via drill 0.35)
  Top 0.3: v46.67,17.14 48.58,15.24 v63.82,15.24 | v60.64,31.11 60.96,30.8 v65.72,30.8
  Bottom 0.3: IC2.27 52.39,13.02 51.75,12.38 51.75,8.89 52.07,8.57 SJ21.2 52.07,8.26 59.69,8.26 59.69,5.08 60.33,4.45 62.55,4.45 62.55,10.79 63.82,12.06 | v46.67,17.14 46.67,19.05 48.9,19.05 IC2.34 | IC2.12 62.87,16.51 63.5,15.88 63.5,15.56 v63.82,15.24 63.82,12.06 | v60.64,31.11 60.64,23.81 59.37,22.54 IC2.5 | v65.72,30.8 65.72,12.7 65.09,12.06 63.82,12.06
GPS_ANT_PWR
  Top 0.508: CON2.4 46.99,65.72 45.72,66.99 41.27,66.99 39.37,65.09 RPOLY2.1
GPS_HF
  Top 0.3: 74.72,51.25 74.72,51.36 IC11.11 | LFP111.2 77.62,51.25 | 85.93,51.24 86.12,51.25 CON11.1 | 76.4,51.24 76.5,51.25 77.11,51.25
  Top 0.406: IC11.11 74.72,51.25 76.4,51.24
  Top 1.422: 77.11,51.25 77.62,51.25 85.93,51.24
GPS_NMEA_RX  (via drill 0.35)
  Top 0.3: 64.72,56.76 IC11.3 64.77,56.52 v56.2,56.52 | v53.66,27.3 v59.69,27.3 | CON2.5 v49.53,57.47 49.53,55.24 51.44,53.34 55.88,53.34 v56.2,53.02
  Bottom 0.3: v59.69,27.3 59.69,23.81 59.05,23.18 IC2.4 | v53.66,27.3 49.53,31.43 v49.53,57.47 | v56.2,53.02 v56.2,56.52
GPS_NMEA_TX  (via drill 0.35)
  Top 0.3: 64.72,57.87 IC11.2 | 64.75,58 IC11.2 | v50.8,25.4 63.82,25.4 R25.1 | v48.26,64.45 49.21,65.41 49.53,65.41 CON2.6 49.53,66.04 50.48,66.99 55.56,66.99 55.56,64.45 62.23,57.78 64.77,57.78 IC11.2
  Bottom 0.3: v50.8,25.4 48.9,27.3 48.9,56.83 47.31,58.42 47.31,63.5 v48.26,64.45
GPS_PPS  (via drill 0.35)
  Top 0.3: 64.72,55.65 IC11.4 | 64.56,55.49 IC11.4 | 64.5,55.62 IC11.4 | 55.24,55.56 52.07,58.74 CON2.7 | 55.24,55.56 64.45,55.56 IC11.4 | v64.77,13.02 v61.91,13.02 | IC1.12 34.92,45.09 37.47,45.09 39.69,42.86 v55.24,42.86 56.71,42.85 63.76,35.8 63.75,35 v63.82,34.92 | v55.24,54.93 55.24,55.56
  Bottom 0.3: v61.91,13.02 60.64,14.29 IC2.16 | v64.77,13.02 64.77,33.97 v63.82,34.92 | v55.24,42.86 v55.24,54.93
GPS_VBACKUP  (via drill 0.35)
  Top 0.3: 64.72,53.58 IC11.6 | 64.56,53.58 IC11.6 | CON2.2 44.45,65.41 44.77,65.09 45.09,65.09 46.04,64.14 46.04,62.87 48.9,62.87 51.12,60.64 51.12,57.47 v52.07,57.47 52,57.25 52,55.25 52.07,55.24 53.34,53.98 56.52,53.98 56.83,53.66 62.75,53.66 | 62.75,53.66 64.45,53.66 IC11.6 | v68,47.5 68,39.5 C81.+ | 62.75,53.66 v62.75,52.75 | 62.75,53.75 62.75,53.66 | v60.5,49.5 55.25,49.5 D82.C
  Bottom 0.3: v52.07,57.47 52.07,62.23 | v62.75,52.75 67,48.5 | 67,48.5 v68,47.5 | v60.5,49.5 63.25,46.75 65.25,46.75 67,48.5
INT1  (via drill 0.35)
  Top 0.3: v18.38,12.38 22,12.38 25.38,9 JP3.2
  Bottom 0.3: v18.38,12.38 15,15.75 15,46.75 IC1.5
ISP_MISO  (via drill 0.35)
  Top 0.3: v28.89,59.69 29.53,60.33 30.48,60.33 R22.1 | CON4.1 2.54,37.47 5.71,40.64 5.75,40.62 25,40.62 v25.08,40.64
  Bottom 0.3: v28.89,59.69 26.67,57.47 26.67,43.5 24.45,41.27 v25.08,40.64
ISP_MOSI  (via drill 0.35)
  Top 0.3: v16.83,68.58 1.27,68.58 1.27,47.94 5.08,44.13 CON4.4
  Bottom 0.3: v16.83,68.58 33.02,68.58 IC1.17
ISP_SCK  (via drill 0.35)
  Top 0.3: v19.05,56.2 20,57.15 24.45,57.15 R23.2 | v15.88,39.37 6.99,39.37 5.08,37.47 CON4.3
  Bottom 0.3: v19.05,56.2 19.05,45.72 19,45.62 15.88,42.5 v15.88,39.37
ISP_VTARGET
  Top 0.3: CON4.2 2.54,38.73 1.91,38.73 1.59,38.42 1.59,8.89 7.3,8.89 11.11,5.08 17.78,5.08 JP2.1
JTAG_SRST  (via drill 0.35)
  Top 0.3: v50.8,33.66 48.26,33.66 47.62,33.02 44.13,33.02 43.18,33.97 v41.59,33.97 40.64,34.92 v35.56,34.92 | v41.91,60.01 41.59,60.33 35.56,60.33 R21.2 | 16.83,7.62 14,7.62 12.75,6.38 JP1.2 | 16.83,7.62 33.75,7.62 33.75,9.12 35,10.38 35.12,10.38 35.5,10.75 CON5.6 35.56,11.11 36.2,11.75 v36.83,11.75 | CON4.5 7.62,37.15 6.35,35.88 5.71,35.88 5.4,35.56 5.4,16.83 6.99,16.83 13.65,10.16 14.29,10.16 16.83,7.62
  Bottom 0.3: v50.8,33.66 54.61,29.84 54.61,24.77 IC2.44 | v41.59,33.97 41.91,34.29 v41.91,60.01 | v36.83,11.75 36.2,12.38 36.2,33.02 35.56,33.66 v35.56,34.92
JTAG_TCK  (via drill 0.35)
  Top 0.3: v31.75,4.76 30.8,4.76 30.48,4.45 CON5.1 | v32.38,14.92 43.18,14.92 46.67,18.41 v63.82,18.41
  Bottom 0.3: v31.75,4.76 32.38,5.4 v32.38,14.92 | v63.82,18.41 64.14,18.73 64.14,19.68 63.5,20.32 62.87,20.32 62.23,19.68 IC2.10
JTAG_TDI  (via drill 0.35)
  Top 0.3: v58.74,32.07 70.17,32.07 72.07,30.16 81.6,30.16 81.6,7.94 81.28,7.62 66.67,7.62 66.04,6.99 63.5,6.99 62.87,7.62 61.59,7.62 58.74,4.76 40.96,4.76 40.64,4.45 CON5.9
  Bottom 0.3: v58.74,32.07 57.15,30.48 57.15,24.77 IC2.1
JTAG_TDO  (via drill 0.35)
  Top 0.3: v47.31,8.26 34.61,8.26 34.61,5.71 33.66,4.76 33.34,4.76 33.02,4.45 CON5.3
  Bottom 0.3: v47.31,8.26 48.58,9.53 48.58,14.92 49.53,15.88 IC2.32
JTAG_TMS  (via drill 0.35)
  Top 0.3: v53.66,9.21 51.75,7.3 37.15,7.3 37.15,5.71 36.2,4.76 35.88,4.76 35.56,4.45 CON5.5
  Bottom 0.3: v53.66,9.21 54.61,10.16 54.61,10.79 IC2.23
JTAG_VREF  (via drill 0.35)
  Top 0.3: v34.29,11.75 33.66,11.75 33.02,11.11 CON5.4 | v35.24,15.88 37.47,18.1 R81.1
  Bottom 0.3: v34.29,11.75 35.24,12.7 v35.24,15.88
MCU_RXD  (via drill 0.35)
  Top 0.3: v62.23,33.02 57.78,37.47 43.18,37.47 42.23,36.51 38.1,36.51 36.2,38.42 31.75,38.42 28.57,35.24 23.81,35.24 22.54,33.97 21.27,33.97 16.83,38.42 v11.75,38.42
  Bottom 0.3: v62.23,33.02 63.18,32.07 63.18,22.86 61.28,20.95 IC2.8 | v11.75,38.42 7.62,42.55 IC1.2
MCU_TXD  (via drill 0.35)
  Top 0.3: v63.82,33.66 64.77,34.61 v64.77,47.62 | v54.61,67.94 53.66,68.9 19.05,68.9 v17.78,67.63
  Bottom 0.3: v63.82,33.66 63.82,22.23 61.91,20.32 IC2.9 | v64.77,47.62 58.42,53.98 58.42,56.52 54.61,60.33 v54.61,67.94 | v17.78,67.63 8.89,67.63 8.89,48.26 IC1.3
MISO
  Top 0.3: IC1.18 R22.2
N$1
  Top 0.3: IC1.28 5.08,59.37 10.79,65.09 11.11,65.09 11.43,65.41 CON6.2
N$3
  Top 0.3: IC1.27 7.62,58.42 11.43,62.23 12.38,62.23 12.38,64.14 13.34,65.09 13.65,65.09 13.97,65.41 CON6.4
N$42  (via drill 0.35)
  Top 0.3: v72.08,26.61 72.12,26.62 67,26.62 R61.2
  Bottom 0.406: v72.08,26.61 v72.08,26.62 CON3.1
N$44  (via drill 0.35)
  Top 0.3: v80.01,16.83 73.34,10.16 64.77,10.16 R72.2
  Bottom 0.3: IC3.7 78.11,16.83 C72.2 78.42,16.83 v80.01,16.83
N$45
  Bottom 0.3: IC3.6 76.83,16.51 76.52,16.83 C72.1
N$47
  Bottom 0.3: R71.1 73.03,2.54 72.71,2.86 72.71,3.81 71.75,4.76 71.75,5.08 C71.2 71.75,5.4 IC3.15
N$48
  Bottom 0.3: IC3.14 73.03,5.4 C71.1
N_ADC_PULL  (via drill 0.35)
  Top 0.3: 41.27,23.18 39.37,25.08 D202.A 39.05,25.4 34.92,29.53 v33.02,29.53 | 41.27,23.18 44.45,23.18 D201.C | 41.27,23.18 39.69,21.59 36.83,21.59 34.92,19.68 31.43,19.68 30.48,18.73 C22.+ | 30.8,40.64 31.11,40.96 R13.2 | 30.8,40.64 29.21,39.05 IC4.1 | 30.8,40.64 v30.48,40.96 | IC1.23 19.68,52.7 v28.89,52.7
  Bottom 0.3: C21.1 30.48,39.69 v30.48,40.96 29.21,42.23 29.21,52.39 v28.89,52.7 | v33.02,29.53 33.02,36.51 C21.1 | C21.1
N_PWM_PULL
  Top 0.3: IC1.11 30.48,45.4 R13.1
N_USB_DISC  (via drill 0.35)
  Top 0.3: v36.51,33.97 R3.2 | v61.59,9.84 61.28,10.16 v41.91,10.16
  Bottom 0.3: 36.83,34.29 v36.51,33.97 | 36.83,34.29 36.83,53.34 IC1.15 | v61.59,9.84 61.59,10.79 62.87,12.06 62.87,15.24 62.23,15.88 IC2.13 | v41.91,10.16 40.01,10.16 40.01,10.79 36.83,13.97 36.83,34.29
N_USB_DMNS  (via drill 0.35)
  Top 0.3: 18.73,34.29 R1.2 18.73,34.29 | 18.73,34.29 15.56,37.47 v13.02,37.47
  Bottom 0.3: IC1.26 12.7,52.07 IC1.4 12.7,37.78 v13.02,37.47
N_USB_DPLS  (via drill 0.35)
  Top 0.3: v13.97,36.51 14.29,36.51 R2.2
  Bottom 0.3: v13.97,36.51 13.97,53.34 IC1.25
PHASE_ERROR  (via drill 0.35)
  Top 0.3: v47.94,24.13 53.34,29.53 60.64,29.53 61.28,28.89 64.77,28.89 R51.1
  Bottom 0.3: v47.94,24.13 47.94,21.27 49.53,19.68 IC2.35
RESET  (via drill 0.35)
  Top 0.3: IC1.1 6.03,46.99 6.03,43.5 6.99,42.55 17.46,42.55 R41.2 | v5.71,15.88 JP1.1
  Bottom 0.3: v5.71,15.88 5.08,16.51 IC1.1
SCK
  Top 0.3: IC1.19 27.62,54.61 R23.1
SS
  Top 0.3: IC1.16 R21.1
SW  (via drill 0.35)
  Top 0.508: 42,45 42,46.75 IC6.1 | 42,45 42.75,44.25 50.25,44.25 51.5,45.5 D211.C | v41,43.75 42,44.75 42,45
  Bottom 0.508: v41,43.75 41,42.75 39.5,41.25 39.5,40.75 L211.2
SYNC  (via drill 0.35)
  Top 0.3: v49.53,21.91 51.12,20.32 v66.99,20.32
  Bottom 0.3: v49.53,21.91 50.48,20.95 IC2.37 | v66.99,20.32 67.31,20 67.31,4.45 70.48,1.27 74.61,1.27 74.61,7.94 74.3,8.26 IC3.13
TOSC1
  Top 0.3: IC1.9 26.67,46.99 26.67,42.55 IC4.3
USB_D_MIN  (via drill 0.35)
  Top 0.3: 29.21,27.94 27.62,29.53 21.59,29.53 20.56,30.56 | 20.56,30.56 R1.1 | v31.11,32.7 29.53,32.7 29.21,32.38 R3.1 | v32.07,30.48 29.53,27.94 29.21,27.94 | 29.21,27.94 D1.C | CON1.2 15.25,27.38 15,27.62 13.62,27.62 13.25,28 13.25,30.5 20.5,30.5 20.56,30.56
  Bottom 0.3: v31.11,32.7 32.07,31.75 v32.07,30.48
USB_D_PLS  (via drill 0.35)
  Top 0.3: D2.C 22.86,27.62 R4.2 19,27.75 17.12,29.62 v16.75,29.62 15.75,28.62 15.38,28.62 CON1.3 | v16.75,32.25 16.25,32.25 16.25,34.25 R2.1
  Bottom 0.3: v16.75,29.62 v16.75,32.25
USB_PWR
  Top 0.3: RPOLY1.1 11.38,15.25 15.25,19.12 15.25,24.75 CON1.1
VCC  (via drill 0.35)
  Top 0.508: 60.17,3.33 61.91,5.08 R72.1 | 60.17,3.33 59.69,2.86 39.37,2.86 38.1,4.13 CON5.7 38.1,3.81 37.15,2.86 23.18,2.86 v20.95,5.08 | 79.22,5.56 76.83,3.17 v69.85,3.17 60.33,3.17 60.17,3.33 | 79.22,5.56 v80.33,6.67 | 79.22,5.56 v78.42,6.35 | v15.24,60.01 14.29,59.05 13.97,59.05 CON6.3 | JP2.2 16.83,11.11 16.83,15.25 | 16.83,15.25 16.83,16.83 18.1,16.83 | 18.1,16.83 24.13,16.83 C1.+ 24.13,17.14 24.45,16.83 33.34,16.83 35.88,19.37 37.78,19.37 38.1,19.68 R81.2 45.72,20 45.72,23.5 49.21,26.99 49.53,26.99 49.53,30.48 R31.3 49.85,30.8 53.02,30.8 v53.98,31.75 | 18.1,16.83 v18.1,16.51 | 16.83,15.25 14.12,15.25 RPOLY1.2 | v6,58.5 v10,62.5 | 42.75,51.25 42.75,53.25 C211.+ 42.75,53.5 42.75,57.25 41.75,58.25 R213.1 | 42.75,51.25 42.75,50.25 42.25,49.75 IC6.5 | 42.75,51.25 21.5,51.25 v21.5,50.5 | v22.88,41.75 21.38,41.75 20,43.12 R41.1
  Bottom 0.508: 71.75,14.61 73.03,14.61 IC3.3 | 70.33,3.65 70.17,3.81 70.17,7.94 70.48,8.26 IC3.16 70.48,8.57 68.26,10.79 68.26,20.64 67.94,20.95 67.94,22.54 69.53,22.54 71.44,20.64 71.44,14.92 71.75,14.61 | 70.33,3.65 R71.2 | 71.75,14.61 IC3.2 | 78.11,8.26 76.83,8.26 IC3.11 | v80.33,6.67 80.33,8.26 C931.1 | 78.11,8.26 78.42,7.94 v78.42,6.35 | 78.11,8.26 IC3.10 | v69.85,3.17 70.33,3.65 | v15.24,60.01 15.24,62.5 | 15.24,62.5 15.24,63.18 16.83,64.77 L31.2 | 55.56,33.66 61.28,33.66 62.23,34.61 IC5.5 | 55.56,33.66 C951.1 | 55.56,33.66 53.98,32.07 v53.98,31.75 | v18.1,16.51 C2.1 | v20.95,5.08 19.37,6.67 19.37,11 | 19.37,11 19.37,17.46 C2.1 | v10,62.5 15.24,62.5 | v6,58.5 3.5,56 3.5,16.5 9,11 19.37,11 | 19.5,11 19.37,11 | v21.5,50.5 21.5,47 20.5,47 IC1.7 20.62,46.75 20.62,42.25 21.12,41.75 | C911.1 23.75,43.12 23.75,42.62 v22.88,41.75 21.12,41.75 | 21.12,41.75 21.12,40.88 19.5,39.25 19.5,18 C2.1
VCC_3V3_SJ2  (via drill 0.35)
  Top 0.3: v50.8,12.38 50.16,13.02 v47.62,13.02 | v61.59,29.84 61.28,30.16 57.47,30.16 54.93,32.7 50.48,32.7 50.16,33.02 48.9,33.02 v46.04,30.16 | v47.94,17.14 v63.82,17.14
  Bottom 0.3: 47.94,16.51 47.31,16.51 46.99,16.19 | 47.94,16.51 48.9,16.51 IC2.33 | 45.72,16.19 44.45,16.19 SJ22.1 | 45.72,16.19 46.99,16.19 | v50.8,12.38 50.8,12.7 51.75,13.65 IC2.28 | v47.62,13.02 46.99,13.65 46.99,16.19 | v61.59,29.84 61.28,29.53 61.28,23.18 60.01,21.91 IC2.6 | v46.04,30.16 45.72,29.84 45.72,16.19 | v63.82,17.14 62.87,18.1 62.87,19.05 IC2.11 | 47.94,16.51 v47.94,17.14

### Text on the board
Top: Top
Bottom: DF4IAH / 10 MHz Ref.-Osc. / V 2.1 | Bot
tPlace: I2C | GPS | SPI | 10 MHz / Ref-Out | USB-B | JTAG | DW | VT | BL